# EAGLE schematic sparrow (EAGLE 6.5.0)

## Sheet 1 of 10: Microcontroller
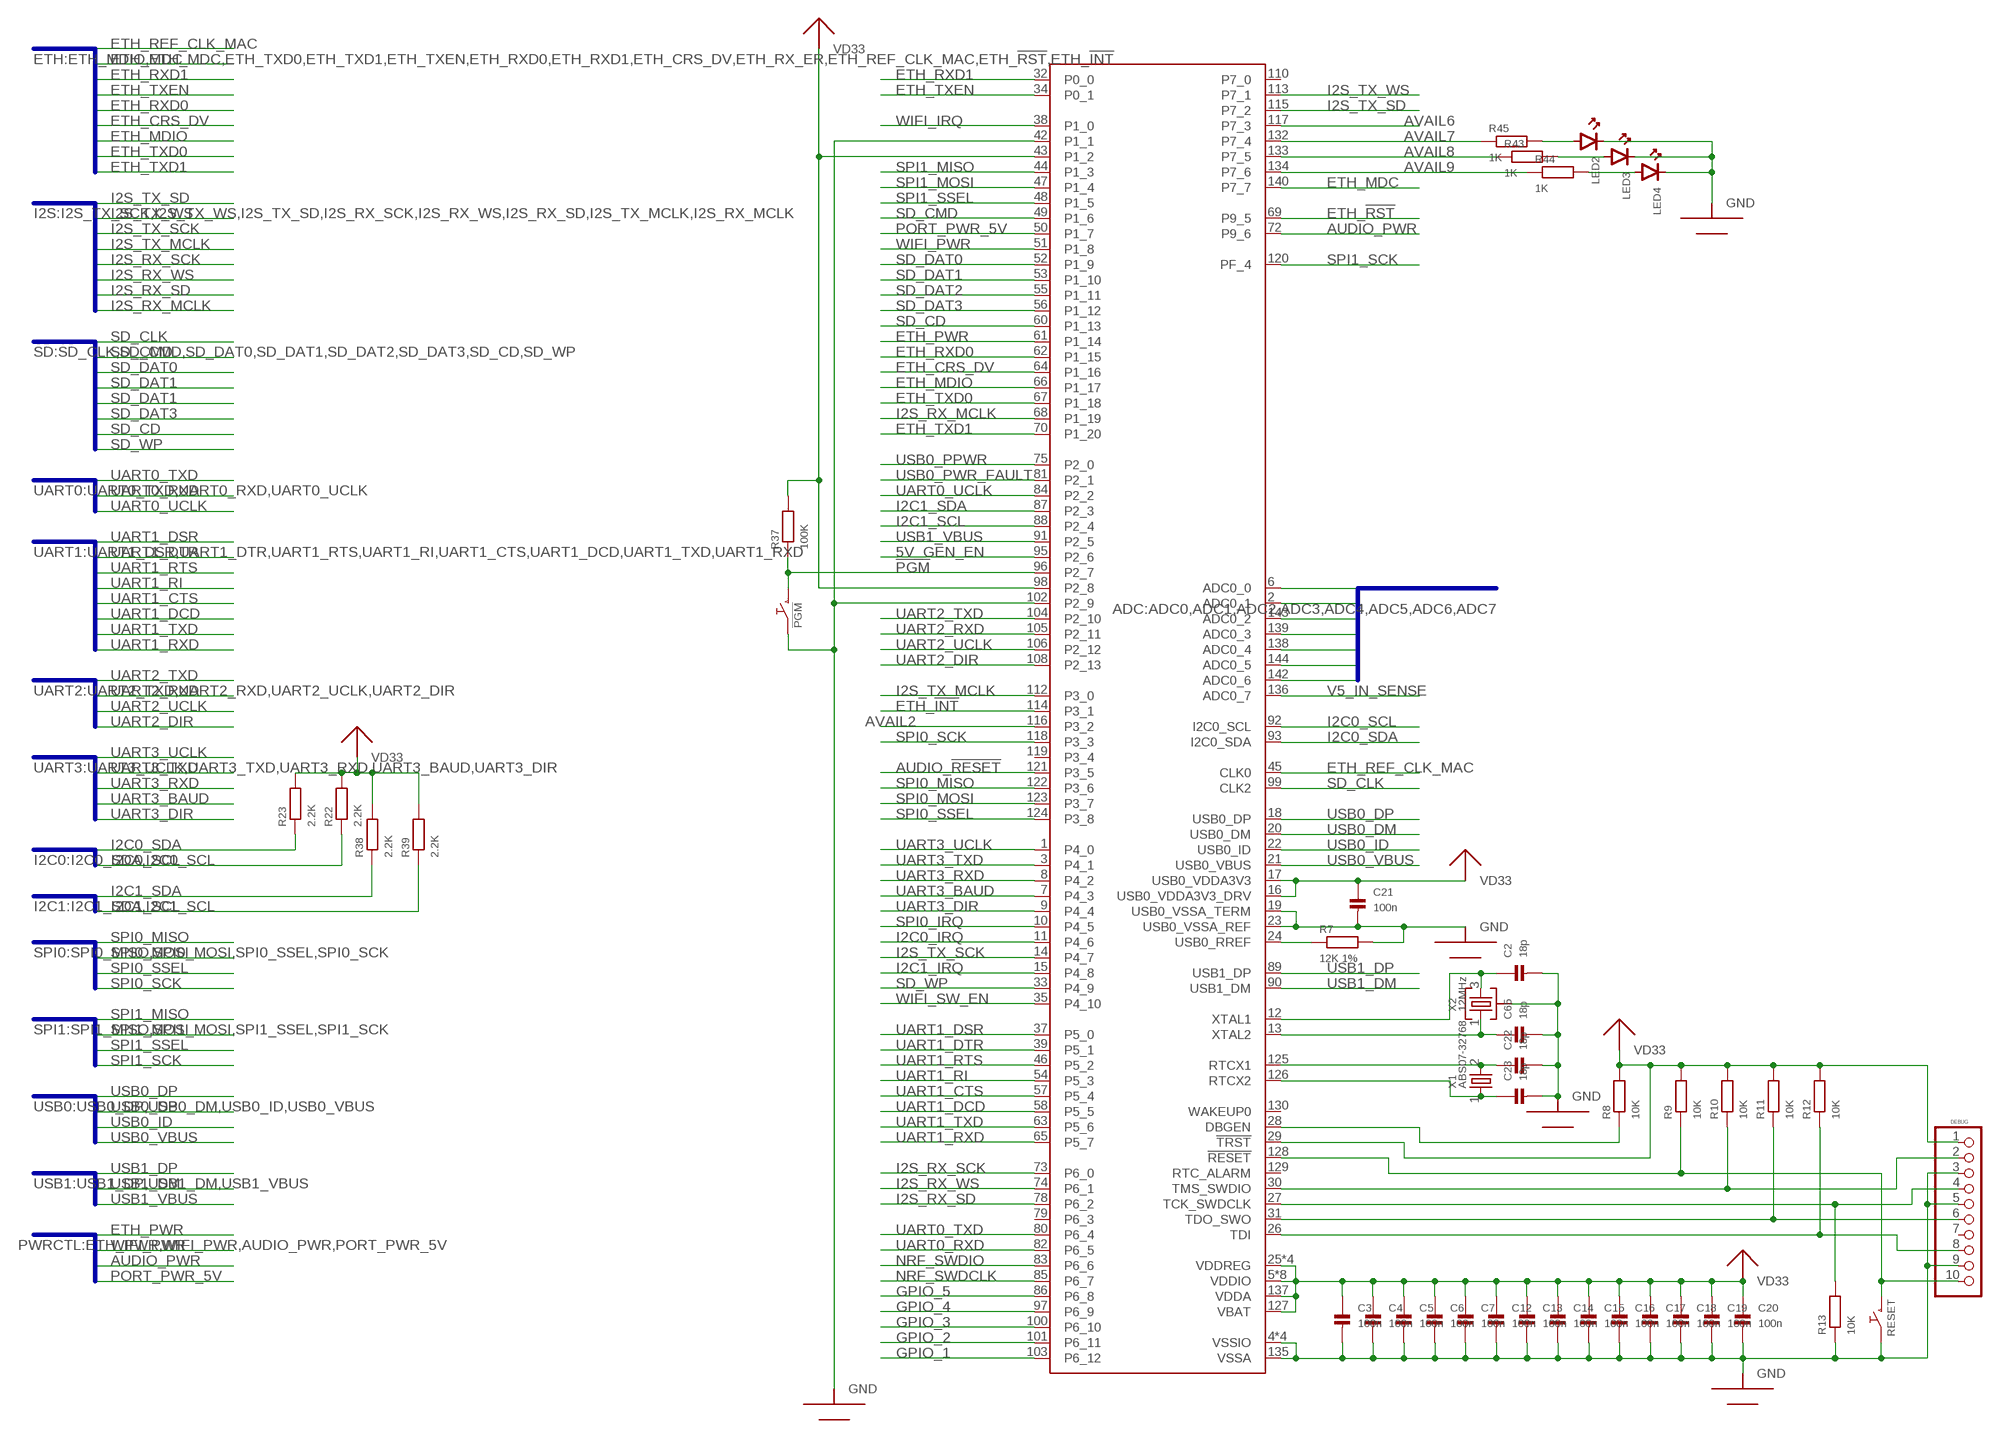
[diagram p0: schematic, sheet 1]

### Parts
!PGM  PUSHBUTTONKMR2XX  [CK-KMR2]
C2  18p  CAP_CERAMIC0603  [0603]
C3  100n  CAP_CERAMIC0603  [0603]
C4  100n  CAP_CERAMIC0603  [0603]
C5  100n  CAP_CERAMIC0603  [0603]
C6  100n  CAP_CERAMIC0603  [0603]
C7  100n  CAP_CERAMIC0603  [0603]
C12  100n  CAP_CERAMIC0603  [0603]
C13  100n  CAP_CERAMIC0603  [0603]
C14  100n  CAP_CERAMIC0603  [0603]
C15  100n  CAP_CERAMIC0603  [0603]
C16  100n  CAP_CERAMIC0603  [0603]
C17  100n  CAP_CERAMIC0603  [0603]
C18  100n  CAP_CERAMIC0603  [0603]
C19  100n  CAP_CERAMIC0603  [0603]
C20  100n  CAP_CERAMIC0603  [0603]
C21  100n  CAP_CERAMIC0603  [0603]
C22  18p  CAP_CERAMIC0603  [0603]
C23  18p  CAP_CERAMIC0603  [0603]
C65  18p  CAP_CERAMIC0603  [0603]
LED2  LED0603  [0603_POLAR]
LED3  LED0603  [0603_POLAR]
LED4  LED0603  [0603_POLAR]
LPC_DEBUG  DEBUG  HEADER-2X5SMD-1.27MM  [2X05_SMT]
MCU  LPC1837  LPC1837JBD144QFP144  [QFP144-0.5]
R7  12K 1%  R-EU_0603  [0603]
R8  10K  R-EU_0603  [0603]
R9  10K  R-EU_0603  [0603]
R10  10K  R-EU_0603  [0603]
R11  10K  R-EU_0603  [0603]
R12  10K  R-EU_0603  [0603]
R13  10K  R-EU_0603  [0603]
R22  2.2K  R-EU_0603  [0603]
R23  2.2K  R-EU_0603  [0603]
R37  100K  R-EU_0603  [0603]
R38  2.2K  R-EU_0603  [0603]
R39  2.2K  R-EU_0603  [0603]
R43  1K  R-EU_0603  [0603]
R44  1K  R-EU_0603  [0603]
R45  1K  R-EU_0603  [0603]
RESET  PUSHBUTTONKMR2XX  [CK-KMR2]
X1  ABS07-32768  CRYSTAL1206  [1206_MINIMELF_COMBO]
X2  12MHz  CRYSTAL_WITH_GROUNDABM8G  [ABM8G]

### Nets
5V_GEN_EN: MCU.95(P2_6) ; also sheet 2
!PGM: !PGM.P$3 !PGM.P$4 MCU.96(P2_7) R37.1
!RESET: LPC_DEBUG.10 MCU.128(!RESET) R9.1 RESET.P$3 RESET.P$4
ADC0: MCU.6(ADC0_0) ; also sheet 8
ADC1: MCU.2(ADC0_1) ; also sheet 8
ADC2: MCU.143(ADC0_2) ; also sheet 8
ADC3: MCU.139(ADC0_3) ; also sheet 8
ADC4: MCU.138(ADC0_4) ; also sheet 8
ADC5: MCU.144(ADC0_5) ; also sheet 8
ADC6: MCU.142(ADC0_6) ; also sheet 2,8
AUDIO_!RESET: MCU.121(P3_5) ; also sheet 7
AUDIO_PWR: MCU.72(P9_6) ; also sheet 2
AVAIL2: MCU.116(P3_2)
AVAIL6: MCU.117(P7_3)
AVAIL7: MCU.132(P7_4) R45.1
AVAIL8: MCU.133(P7_5) R43.1
AVAIL9: MCU.134(P7_6) R44.1
DBGEN: MCU.28(DBGEN) R8.1
ETH_!INT: MCU.114(P3_1) ; also sheet 4
ETH_!RST: MCU.69(P9_5) ; also sheet 4
ETH_CRS_DV: MCU.64(P1_16) ; also sheet 4
ETH_MDC: MCU.140(P7_7) ; also sheet 4
ETH_MDIO: MCU.66(P1_17) ; also sheet 4
ETH_PWR: MCU.61(P1_14) ; also sheet 2
ETH_REF_CLK_MAC: MCU.45(CLK0) ; also sheet 4
ETH_RXD0: MCU.62(P1_15) ; also sheet 4
ETH_RXD1: MCU.32(P0_0) ; also sheet 4
ETH_TXD0: MCU.67(P1_18) ; also sheet 4
ETH_TXD1: MCU.70(P1_20) ; also sheet 4
ETH_TXEN: MCU.34(P0_1) ; also sheet 4
GND: !PGM.P$1 !PGM.P$2 C2.2 C3.2 C4.2 C5.2 C6.2 C7.2 C12.2 C13.2 C14.2 C15.2 C16.2 C17.2 C18.2 C19.2 C20.2 C21.2 C22.2 C23.2 C65.2 LED2.K(CATHODE) LED3.K(CATHODE) LED4.K(CATHODE) LPC_DEBUG.3 LPC_DEBUG.5 LPC_DEBUG.9 MCU.4(VSSIO) MCU.19(USB0_VSSA_TERM) MCU.23(USB0_VSSA_REF) MCU.40(VSSIO) MCU.42(P1_1) MCU.76(VSSIO) MCU.102(P2_9) MCU.109(VSSIO) MCU.135(VSSA) R7.2 R13.1 RESET.P$1 RESET.P$2 X2.2(GND) X2.4(GND) ; also sheet 2,3,4,5,6,7,8,9
GPIO_1: MCU.103(P6_12) ; also sheet 8
GPIO_2: MCU.101(P6_11) ; also sheet 8
GPIO_3: MCU.100(P6_10) ; also sheet 8
GPIO_4: MCU.97(P6_9) ; also sheet 8
GPIO_5: MCU.86(P6_8) ; also sheet 8
I2C0_IRQ: MCU.11(P4_6) ; also sheet 8
I2C0_SCL: MCU.92(I2C0_SCL) R22.1 ; also sheet 7,8
I2C0_SDA: MCU.93(I2C0_SDA) R23.1 ; also sheet 7,8
I2C1_IRQ: MCU.15(P4_8) ; also sheet 8
I2C1_SCL: MCU.88(P2_4) R39.1 ; also sheet 8
I2C1_SDA: MCU.87(P2_3) R38.1 ; also sheet 8
I2S_RX_MCLK: MCU.68(P1_19) ; also sheet 7
I2S_RX_SCK: MCU.73(P6_0) ; also sheet 7
I2S_RX_SD: MCU.78(P6_2) ; also sheet 7
I2S_RX_WS: MCU.74(P6_1) ; also sheet 7
I2S_TX_MCLK: MCU.112(P3_0) ; also sheet 7
I2S_TX_SCK: MCU.14(P4_7) ; also sheet 7
I2S_TX_SD: MCU.115(P7_2) ; also sheet 7
I2S_TX_WS: MCU.113(P7_1) ; also sheet 7
N$1: LED2.A(ANODE) R45.2
N$2: LED3.A(ANODE) R43.2
N$3: LED4.A(ANODE) R44.2
NRF_SWDCLK: MCU.85(P6_7) ; also sheet 9
NRF_SWDIO: MCU.83(P6_6) ; also sheet 9
PORT_PWR_5V: MCU.50(P1_7) ; also sheet 2
RTXC1: C22.1 MCU.125(RTCX1) X1.2
RTXC2: C23.1 MCU.126(RTCX2) X1.1
SD_CD: MCU.60(P1_13) ; also sheet 6
SD_CLK: MCU.99(CLK2) ; also sheet 6
SD_CMD: MCU.49(P1_6) ; also sheet 6
SD_DAT0: MCU.52(P1_9) ; also sheet 6
SD_DAT1: MCU.53(P1_10) ; also sheet 6
SD_DAT2: MCU.55(P1_11) ; also sheet 6
SD_DAT3: MCU.56(P1_12) ; also sheet 6
SD_WP: MCU.33(P4_9) ; also sheet 6
SPI0_IRQ: MCU.10(P4_5) ; also sheet 8
SPI0_MISO: MCU.122(P3_6) ; also sheet 8
SPI0_MOSI: MCU.123(P3_7) ; also sheet 8
SPI0_SCK: MCU.118(P3_3) ; also sheet 8
SPI0_SSEL: MCU.124(P3_8) ; also sheet 8
SPI1_MISO: MCU.44(P1_3) ; also sheet 5
SPI1_MOSI: MCU.47(P1_4) ; also sheet 5
SPI1_SCK: MCU.120(PF_4) ; also sheet 5
SPI1_SSEL: MCU.48(P1_5) ; also sheet 5
SWDCLK: LPC_DEBUG.4 MCU.27(TCK_SWDCLK) R13.2
SWDIO: LPC_DEBUG.2 MCU.30(TMS_SWDIO) R10.1
TDI: LPC_DEBUG.8 MCU.26(TDI) R12.1
TDO_SWO: LPC_DEBUG.6 MCU.31(TDO_SWO) R11.1
UART0_RXD: MCU.82(P6_5) ; also sheet 8
UART0_TXD: MCU.80(P6_4) ; also sheet 8
UART0_UCLK: MCU.84(P2_2) ; also sheet 8
UART1_CTS: MCU.57(P5_4) ; also sheet 9
UART1_DCD: MCU.58(P5_5)
UART1_DSR: MCU.37(P5_0)
UART1_DTR: MCU.39(P5_1)
UART1_RI: MCU.54(P5_3)
UART1_RTS: MCU.46(P5_2) ; also sheet 9
UART1_RXD: MCU.65(P5_7) ; also sheet 9
UART1_TXD: MCU.63(P5_6) ; also sheet 9
UART2_DIR: MCU.108(P2_13) ; also sheet 8
UART2_RXD: MCU.105(P2_11) ; also sheet 8
UART2_TXD: MCU.104(P2_10) ; also sheet 8
UART2_UCLK: MCU.106(P2_12) ; also sheet 8
UART3_BAUD: MCU.7(P4_3) ; also sheet 8
UART3_DIR: MCU.9(P4_4) ; also sheet 8
UART3_RXD: MCU.8(P4_2) ; also sheet 8
UART3_TXD: MCU.3(P4_1) ; also sheet 8
UART3_UCLK: MCU.1(P4_0) ; also sheet 8
USB0_DM: MCU.20(USB0_DM) ; also sheet 3
USB0_DP: MCU.18(USB0_DP) ; also sheet 3
USB0_ID: MCU.22(USB0_ID) ; also sheet 3
USB0_PPWR: MCU.75(P2_0) ; also sheet 2
USB0_PWR_FAULT: MCU.81(P2_1) ; also sheet 2
USB0_RREF: MCU.24(USB0_RREF) R7.1
USB0_VBUS: MCU.21(USB0_VBUS) ; also sheet 3
USB1_DM: MCU.90(USB1_DM) ; also sheet 3
USB1_DP: MCU.89(USB1_DP) ; also sheet 3
USB1_VBUS: MCU.91(P2_5) ; also sheet 3
V5_IN_SENSE: MCU.136(ADC0_7) ; also sheet 2
VD33: C3.1 C4.1 C5.1 C6.1 C7.1 C12.1 C13.1 C14.1 C15.1 C16.1 C17.1 C18.1 C19.1 C20.1 C21.1 LPC_DEBUG.1 MCU.5(VDDIO) MCU.16(USB0_VDDA3V3_DRV) MCU.17(USB0_VDDA3V3) MCU.25(VDDREG) MCU.29(!TRST) MCU.36(VDDIO) MCU.41(VDDIO) MCU.43(P1_2) MCU.59(VDDREG) MCU.71(VDDIO) MCU.77(VDDIO) MCU.94(VDDREG) MCU.98(P2_8) MCU.107(VDDIO) MCU.111(VDDIO) MCU.127(VBAT) MCU.131(VDDREG) MCU.137(VDDA) MCU.141(VDDIO) R8.2 R9.2 R10.2 R11.2 R12.2 R22.2 R23.2 R37.2 R38.2 R39.2 ; also sheet 2,6,7,8,9
WIFI_IRQ: MCU.38(P1_0) ; also sheet 5
WIFI_PWR: MCU.51(P1_8) ; also sheet 2
WIFI_SW_EN: MCU.35(P4_10) ; also sheet 5
XTAL1: C2.1 MCU.12(XTAL1) X2.3
XTAL2: C65.1 MCU.13(XTAL2) X2.1
Unconnected: LPC_DEBUG.7 MCU.79(P6_3) MCU.110(P7_0) MCU.119(P3_4) MCU.129(RTC_ALARM) MCU.130(WAKEUP0)

### Buses
USB0:USB0_DP,USB0_DM,USB0_ID,USB0_VBUS
USB1:USB1_DP,USB1_DM,USB1_VBUS
ADC:ADC0,ADC1,ADC2,ADC3,ADC4,ADC5,ADC6,ADC7
ETH:ETH_MDIO,ETH_MDC,ETH_TXD0,ETH_TXD1,ETH_TXEN,ETH_RXD0,ETH_RXD1,ETH_CRS_DV,ETH_RX_ER,ETH_REF_CLK_MAC,ETH_!RST,ETH_!INT
I2C0:I2C0_SDA,I2C0_SCL
I2S:I2S_TX_SCK,I2S_TX_WS,I2S_TX_SD,I2S_RX_SCK,I2S_RX_WS,I2S_RX_SD,I2S_TX_MCLK,I2S_RX_MCLK
SD:SD_CLK,SD_CMD,SD_DAT0,SD_DAT1,SD_DAT2,SD_DAT3,SD_CD,SD_WP
UART1:UART1_DSR,UART1_DTR,UART1_RTS,UART1_RI,UART1_CTS,UART1_DCD,UART1_TXD,UART1_RXD
UART0:UART0_TXD,UART0_RXD,UART0_UCLK
UART2:UART2_TXD,UART2_RXD,UART2_UCLK,UART2_DIR
UART3:UART3_UCLK,UART3_TXD,UART3_RXD,UART3_BAUD,UART3_DIR
I2C1:I2C1_SDA,I2C1_SCL
SPI0:SPI0_MISO,SPI0_MOSI,SPI0_SSEL,SPI0_SCK
SPI1:SPI1_MISO,SPI1_MOSI,SPI1_SSEL,SPI1_SCK
PWRCTL:ETH_PWR,WIFI_PWR,AUDIO_PWR,PORT_PWR_5V

## Sheet 2 of 10: Power
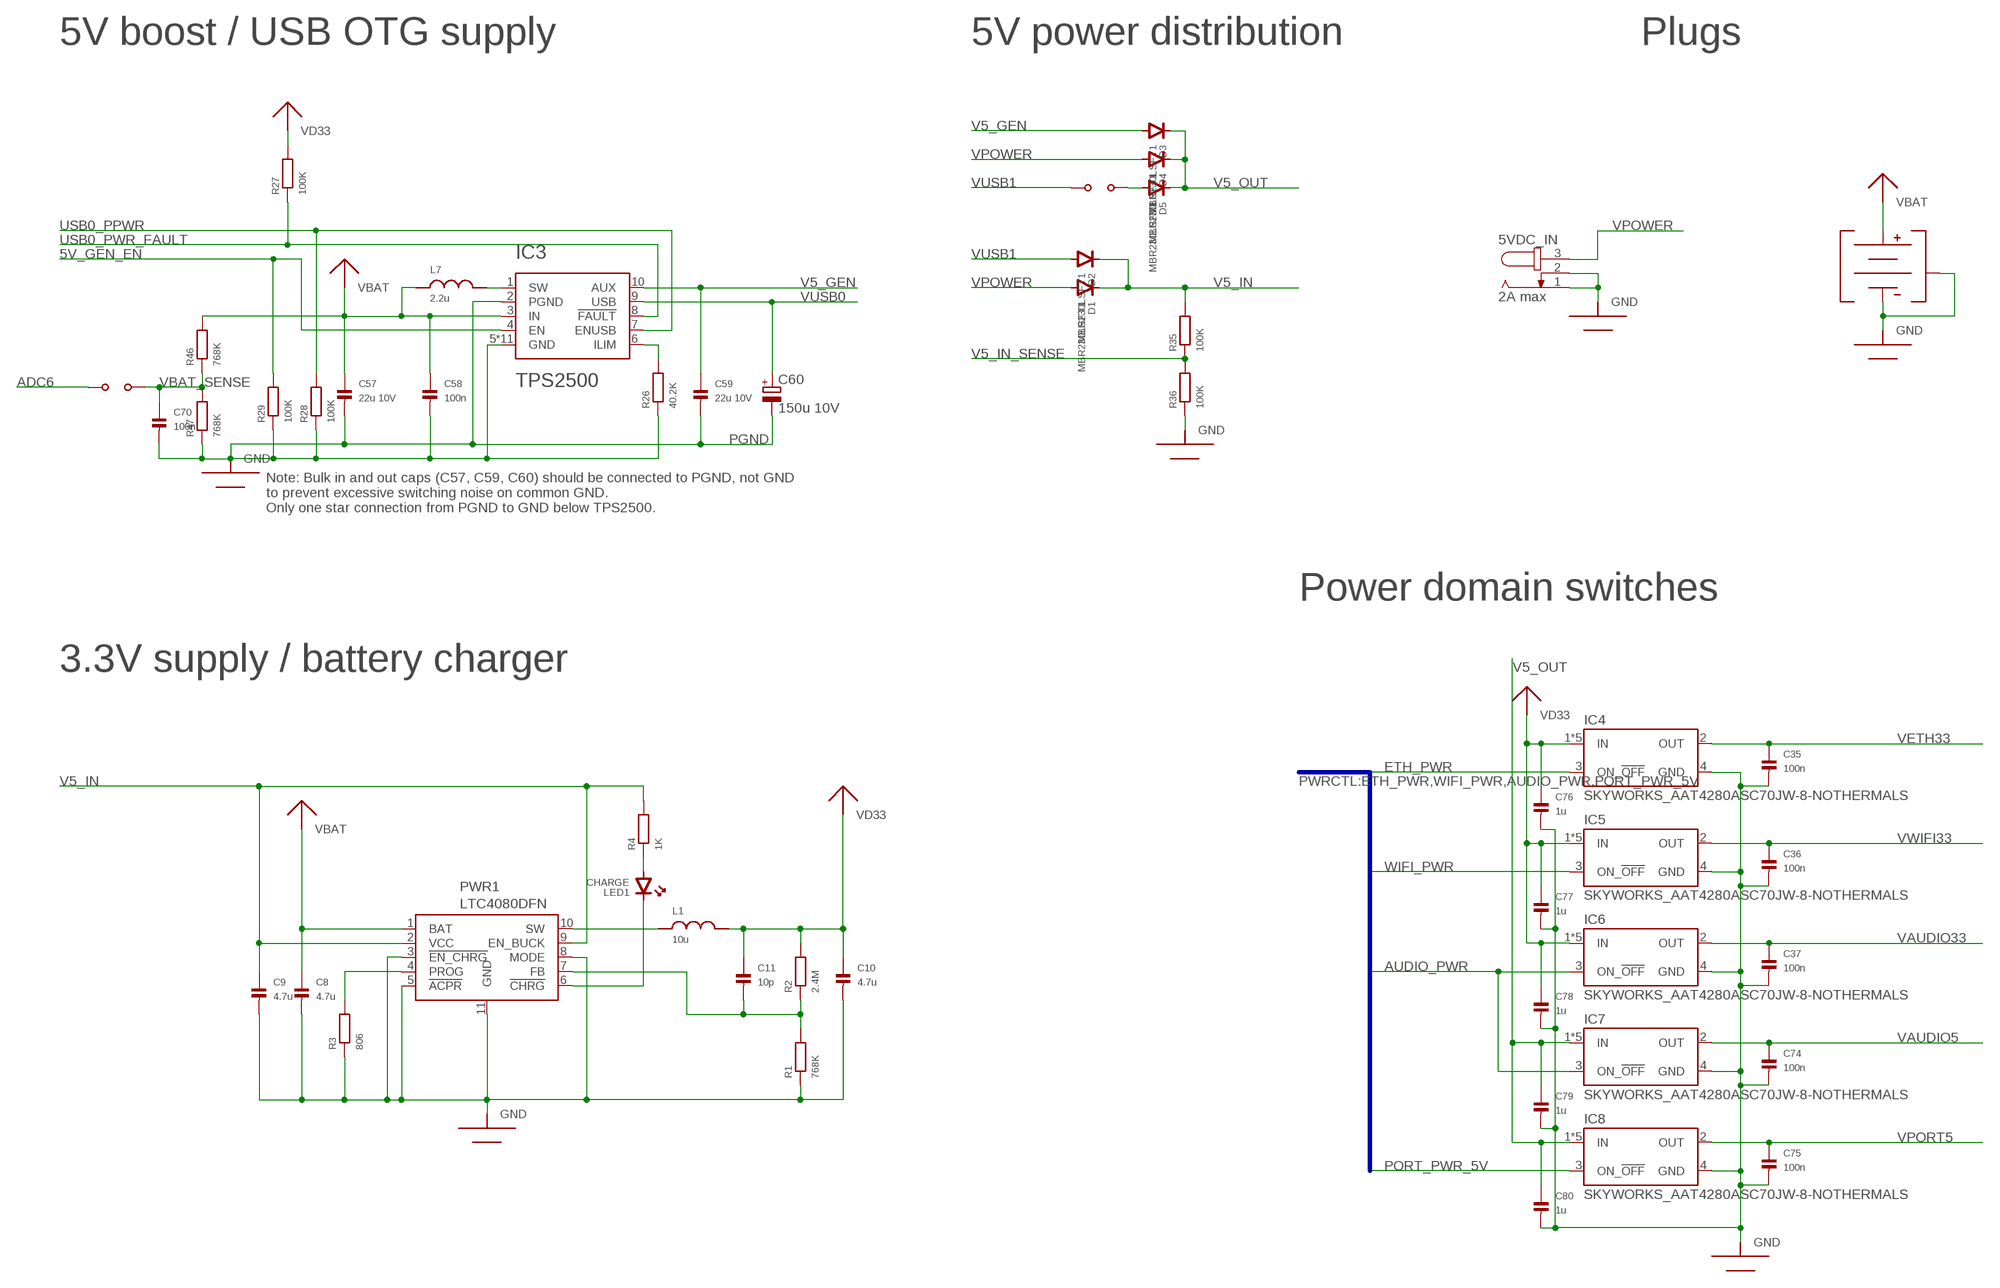
[diagram p1: schematic, sheet 2]

### Parts
5VDC_IN  2A max  JACK-PLUGCUI_PJ102BH  [CUI_PJ_102BH]
BATSNS  JUMPERSOLDER_CLOSED  [0603_SOLDERJUMPER_CLOSED]
BATT  BATTERY_WITH_HOLDER  [S2B-PH-SM4-TB]
C8  4.7u  CAP_CERAMIC0603  [0603]
C9  4.7u  CAP_CERAMIC0603  [0603]
C10  4.7u  CAP_CERAMIC0603  [0603]
C11  10p  CAP_CERAMIC0603  [0603]
C35  100n  CAP_CERAMIC0603  [0603]
C36  100n  CAP_CERAMIC0603  [0603]
C37  100n  CAP_CERAMIC0603  [0603]
C57  22u 10V  CAP_CERAMIC0805  [0805]
C58  100n  CAP_CERAMIC0603  [0603]
C59  22u 10V  CAP_CERAMIC0805  [0805]
C60  150u 10V  CPOL-EU1210  [1210_POLAR]
C70  100n  CAP_CERAMIC0603  [0603]
C74  100n  CAP_CERAMIC0603  [0603]
C75  100n  CAP_CERAMIC0603  [0603]
C76  1u  CAP_CERAMIC0603  [0603]
C77  1u  CAP_CERAMIC0603  [0603]
C78  1u  CAP_CERAMIC0603  [0603]
C79  1u  CAP_CERAMIC0603  [0603]
C80  1u  CAP_CERAMIC0603  [0603]
D1  MBR230LSFT1  DIODESOD123FL  [SOD123FL]
D2  MBR230LSFT1  DIODESOD123FL  [SOD123FL]
D3  MBR230LSFT1  DIODESOD123FL  [SOD123FL]
D4  MBR230LSFT1  DIODESOD123FL  [SOD123FL]
D5  MBR230LSFT1  DIODESOD123FL  [SOD123FL]
IC3  TPS2500  TPS2500SON10  [SON10-0.5-EP-VIAS]
IC4  SKYWORKS_AAT4280ASC70JW-8-NOTHERMALS  [SC70JW-8-NOTHERMALS]
IC5  SKYWORKS_AAT4280ASC70JW-8-NOTHERMALS  [SC70JW-8-NOTHERMALS]
IC6  SKYWORKS_AAT4280ASC70JW-8-NOTHERMALS  [SC70JW-8-NOTHERMALS]
IC7  SKYWORKS_AAT4280ASC70JW-8-NOTHERMALS  [SC70JW-8-NOTHERMALS]
IC8  SKYWORKS_AAT4280ASC70JW-8-NOTHERMALS  [SC70JW-8-NOTHERMALS]
L1  10u  INDUCTOR40X40MM  [INDUCTOR_40X40]
L7  2.2u  INDUCTOR40X40MM  [INDUCTOR_40X40]
LED1  CHARGE  LED0603  [0603_POLAR]
LIM  JUMPERSOLDER_OPEN  [0603_SOLDERJUMPER_OPEN]
PWR1  LTC4080DFN  [LTC4080_DFN]
R1  768K  R-EU_0603  [0603]
R2  2.4M  R-EU_0603  [0603]
R3  806  R-EU_0603  [0603]
R4  1K  R-EU_0603  [0603]
R26  40.2K  R-EU_0603  [0603]
R27  100K  R-EU_0603  [0603]
R28  100K  R-EU_0603  [0603]
R29  100K  R-EU_0603  [0603]
R35  100K  R-EU_0603  [0603]
R36  100K  R-EU_0603  [0603]
R46  768K  R-EU_0603  [0603]
R47  768K  R-EU_0603  [0603]

### Nets
5V_BOOST_SW: IC3.1(SW) L7.P$2
5V_GEN_EN: IC3.4(EN) R29.2 ; also sheet 1
5V_ILIM: IC3.6(ILIM) R26.2
ADC6: BATSNS.1 ; also sheet 1,8
AUDIO_PWR: IC6.3(ON_!OFF) IC7.3(ON_!OFF) ; also sheet 1
CHARGE_!CHRG: LED1.K(CATHODE) PWR1.6(!CHRG)
CHARGE_!CHRG_CURR: LED1.A(ANODE) R4.1
CHARGE_FB: C11.2 PWR1.7(FB) R1.2 R2.1
CHARGE_PROG: PWR1.4(PROG) R3.2
CHARGE_SW: L1.P$1 PWR1.10(SW)
ETH_PWR: IC4.3(ON_!OFF) ; also sheet 1
GND: 5VDC_IN.1 5VDC_IN.2 BATT.2(-) BATT.3(HOLDER) BATT.4(HOLDER) C8.2 C9.2 C10.2 C35.2 C36.2 C37.2 C57.2 C58.2 C59.2 C60.K(-) C70.2 C74.2 C75.2 C76.2 C77.2 C78.2 C79.2 C80.2 IC3.2(PGND) IC3.5(GND) IC3.EXT1(GND) IC3.EXT2(GND) IC3.EXT3(GND) IC3.EXT4(GND) IC3.PAD(GND) IC3.THERM1(GND) IC3.THERM2(GND) IC3.THERM3(GND) IC3.THERM4(GND) IC3.THERM5(GND) IC4.4(GND) IC5.4(GND) IC6.4(GND) IC7.4(GND) IC8.4(GND) PWR1.3(!EN_CHRG) PWR1.5(!ACPR) PWR1.8(MODE) PWR1.11(GND) R1.1 R3.1 R26.1 R28.1 R29.1 R36.1 R47.1 ; also sheet 1,3,4,5,6,7,8,9
PORT_PWR_5V: IC8.3(ON_!OFF) ; also sheet 1
USB0_PPWR: IC3.7(ENUSB) R28.2 ; also sheet 1
USB0_PWR_FAULT: IC3.8(!FAULT) R27.1 ; also sheet 1
V5_GEN [supply2000]: C59.1 D3.A(ANODE) IC3.10(AUX)
V5_IN [supply500]: C9.1 D1.K(CATHODE) D2.K(CATHODE) PWR1.2(VCC) PWR1.9(EN_BUCK) R4.2 R35.2
V5_IN_SENSE: R35.1 R36.2 ; also sheet 1
V5_OUT [supply2000]: C79.1 C80.1 D3.K(CATHODE) D4.K(CATHODE) D5.K(CATHODE) IC7.1(IN) IC7.5(IN) IC7.6(IN) IC7.7(IN) IC7.8(IN) IC8.1(IN) IC8.5(IN) IC8.6(IN) IC8.7(IN) IC8.8(IN)
VAUDIO5 [supply2000]: C74.1 IC7.2(OUT) ; also sheet 7
VAUDIO33: C37.1 IC6.2(OUT) ; also sheet 7
VBAT [supply2000]: BATT.1(+) C8.1 C57.1 C58.1 IC3.3(IN) L7.P$1 PWR1.1(BAT) R46.2
VBAT_SENSE: BATSNS.2 C70.1 R46.1 R47.2
VD33: C10.1 C11.1 C76.1 C77.1 C78.1 IC4.1(IN) IC4.5(IN) IC4.6(IN) IC4.7(IN) IC4.8(IN) IC5.1(IN) IC5.5(IN) IC5.6(IN) IC5.7(IN) IC5.8(IN) IC6.1(IN) IC6.5(IN) IC6.6(IN) IC6.7(IN) IC6.8(IN) L1.P$2 R2.2 R27.2 ; also sheet 1,6,7,8,9
VETH33: C35.1 IC4.2(OUT) ; also sheet 4
VPORT5 [supply2000]: C75.1 IC8.2(OUT) ; also sheet 8
VPOWER [supply2000]: 5VDC_IN.3 D1.A(ANODE) D4.A(ANODE)
VUSB0 [supply500]: C60.A(+) IC3.9(USB) ; also sheet 3
VUSB1 [supply2000]: D2.A(ANODE) LIM.1 ; also sheet 3
VUSB1_V5_OUT [supply2000]: D5.A(ANODE) LIM.2
VWIFI33: C36.1 IC5.2(OUT) ; also sheet 5
WIFI_PWR: IC5.3(ON_!OFF) ; also sheet 1

### Buses
PWRCTL:ETH_PWR,WIFI_PWR,AUDIO_PWR,PORT_PWR_5V

### Notes on the sheet
- 5V boost / USB OTG supply | 5V power distribution | Plugs
- PGND
- Note: Bulk in and out caps (C57, C59, C60) should be connected to PGND, not GND
  to prevent excessive switching noise on common GND.
  Only one star connection from PGND to GND below TPS2500.
- Power domain switches
- 3.3V supply / battery charger

## Sheet 3 of 10: USB
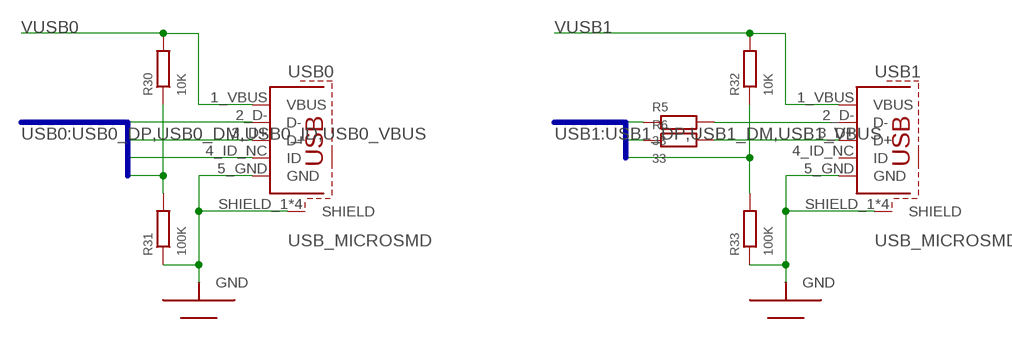
[diagram p2: schematic, sheet 3]

### Parts
R5  33  R-EU_0603  [0603]
R6  33  R-EU_0603  [0603]
R30  10K  R-EU_0603  [0603]
R31  100K  R-EU_0603  [0603]
R32  10K  R-EU_0603  [0603]
R33  100K  R-EU_0603  [0603]
USB0  USB_MICROSMD  [USB_MICRO_SMD]
USB1  USB_MICROSMD  [USB_MICRO_SMD]

### Nets
GND: R31.1 R33.1 USB0.5_GND(GND) USB0.SHIELD_1(SHIELD) USB0.SHIELD_2(SHIELD) USB0.SHIELD_3(SHIELD) USB0.SHIELD_4(SHIELD) USB1.5_GND(GND) USB1.SHIELD_1(SHIELD) USB1.SHIELD_2(SHIELD) USB1.SHIELD_3(SHIELD) USB1.SHIELD_4(SHIELD) ; also sheet 1,2,4,5,6,7,8,9
USB0_DM: USB0.2_D-(D-) ; also sheet 1
USB0_DP: USB0.3_D+(D+) ; also sheet 1
USB0_ID: USB0.4_ID_NC(ID) ; also sheet 1
USB0_VBUS: R30.1 R31.2 ; also sheet 1
USB1_DM: R5.1 ; also sheet 1
USB1_DM_LINE: R5.2 USB1.2_D-(D-)
USB1_DP: R6.1 ; also sheet 1
USB1_VBUS: R32.1 R33.2 ; also sheet 1
USB_DP_LINE: R6.2 USB1.3_D+(D+)
VUSB0 [supply500]: R30.2 USB0.1_VBUS(VBUS) ; also sheet 2
VUSB1 [supply2000]: R32.2 USB1.1_VBUS(VBUS) ; also sheet 2
Unconnected: USB1.4_ID_NC(ID)

### Buses
USB0:USB0_DP,USB0_DM,USB0_ID,USB0_VBUS
USB1:USB1_DP,USB1_DM,USB1_VBUS

## Sheet 4 of 10: Ethernet
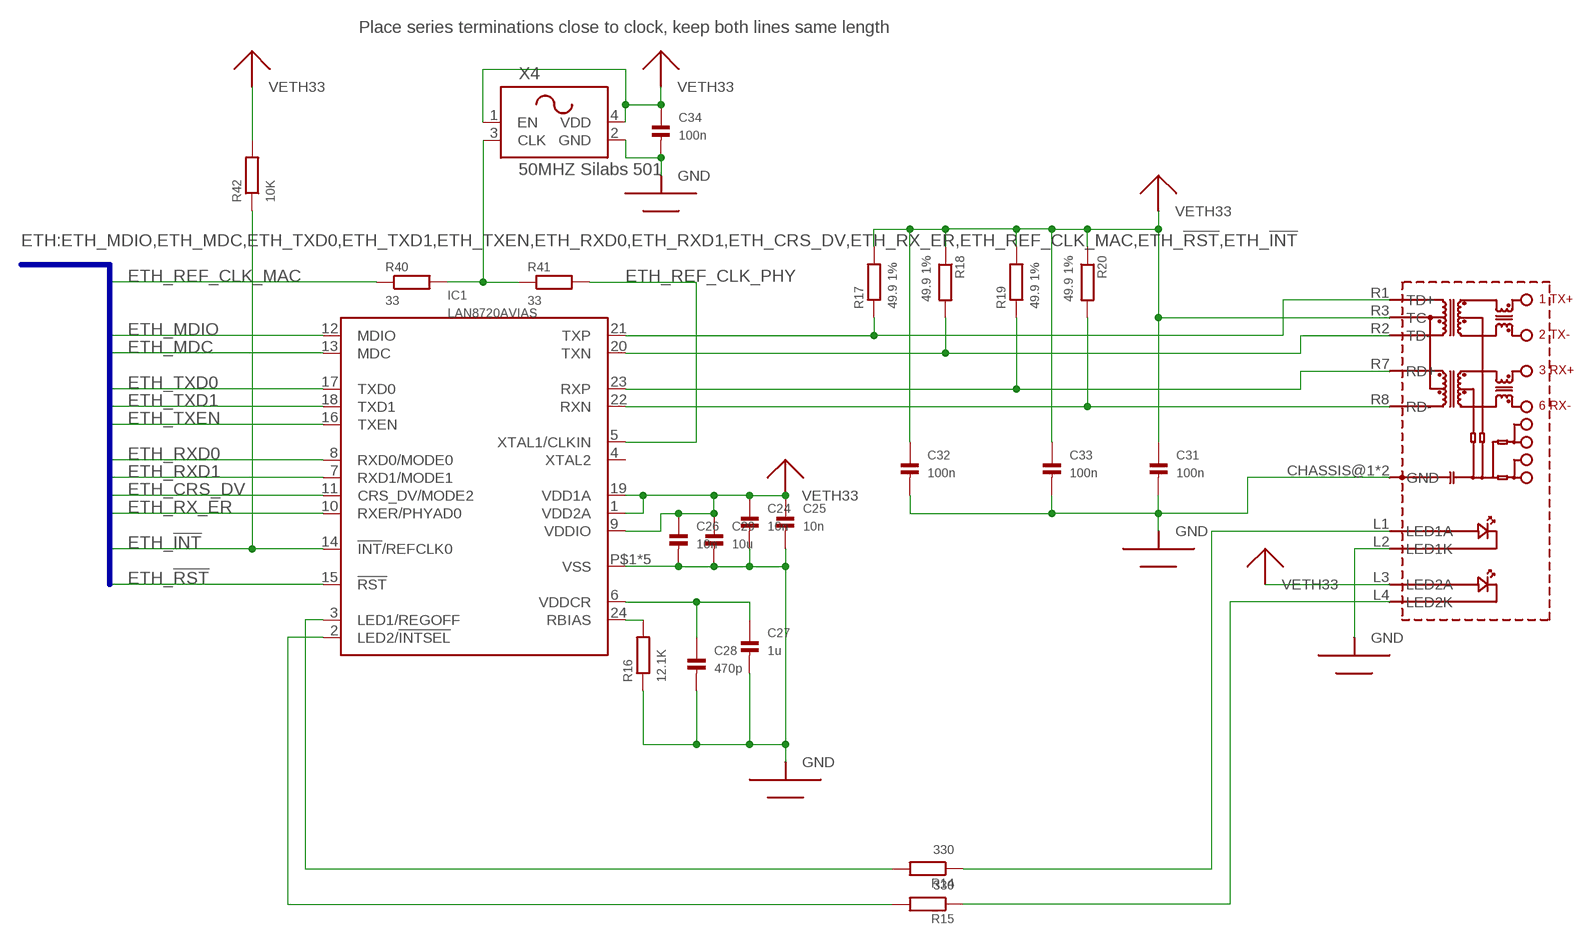
[diagram p3: schematic, sheet 4]

### Parts
C24  10n  CAP_CERAMIC0603  [0603]
C25  10n  CAP_CERAMIC0603  [0603]
C26  10n  CAP_CERAMIC0603  [0603]
C27  1u  CAP_CERAMIC0603  [0603]
C28  470p  CAP_CERAMIC0603  [0603]
C29  10u  CAP_CERAMIC0603  [0603]
C31  100n  CAP_CERAMIC0603  [0603]
C32  100n  CAP_CERAMIC0603  [0603]
C33  100n  CAP_CERAMIC0603  [0603]
C34  100n  CAP_CERAMIC0603  [0603]
ETH  ETHERNET_JACK_LEDSRB1-125BAG1A  [RJ45-RB1-125BAG1A]
IC1  LAN8720AVIAS  [QFN24-0.5-EP-VIAS]
R14  330  R-EU_0603  [0603]
R15  330  R-EU_0603  [0603]
R16  12.1K  R-EU_0603  [0603]
R17  49.9 1%  R-EU_0603  [0603]
R18  49.9 1%  R-EU_0603  [0603]
R19  49.9 1%  R-EU_0603  [0603]
R20  49.9 1%  R-EU_0603  [0603]
R40  33  R-EU_0603  [0603]
R41  33  R-EU_0603  [0603]
R42  10K  R-EU_0603  [0603]
X4  50MHZ Silabs 501  OSCILLATOR25X20  [CRYSTAL25X20]

### Nets
ETH_!INT: IC1.14(!INT!/REFCLK0) R42.1 ; also sheet 1
ETH_!RST: IC1.15(!RST) ; also sheet 1
ETH_CRS_DV: IC1.11(CRS_DV/MODE2) ; also sheet 1
ETH_LED1: IC1.3(LED1/REGOFF) R14.2
ETH_LED1_CURR: ETH.L1(LED1A) R14.1
ETH_LED2: IC1.2(LED2/!INTSEL) R15.2
ETH_LED2_CURR: ETH.L4(LED2K) R15.1
ETH_MDC: IC1.13(MDC) ; also sheet 1
ETH_MDIO: IC1.12(MDIO) ; also sheet 1
ETH_RBIAS: IC1.24(RBIAS) R16.2
ETH_REF_CLK: R40.2 R41.1 X4.3(CLK)
ETH_REF_CLK_MAC: R40.1 ; also sheet 1
ETH_REF_CLK_PHY: IC1.5(XTAL1/CLKIN) R41.2
ETH_RX_ER: IC1.10(RXER/PHYAD0)
ETH_RXD0: IC1.8(RXD0/MODE0) ; also sheet 1
ETH_RXD1: IC1.7(RXD1/MODE1) ; also sheet 1
ETH_RXN: ETH.R8(RD-) IC1.22(RXN) R20.2
ETH_RXP: ETH.R7(RD+) IC1.23(RXP) R19.1
ETH_TXD0: IC1.17(TXD0) ; also sheet 1
ETH_TXD1: IC1.18(TXD1) ; also sheet 1
ETH_TXEN: IC1.16(TXEN) ; also sheet 1
ETH_TXN: ETH.R2(TD-) IC1.20(TXN) R18.2
ETH_TXP: ETH.R1(TD+) IC1.21(TXP) R17.1
ETH_VDDCR: C27.1 C28.1 IC1.6(VDDCR)
GND: C24.2 C25.2 C26.2 C27.2 C28.2 C29.2 C31.2 C32.2 C33.2 C34.2 ETH.CHASSIS@1(GND) ETH.CHASSIS@2(GND) ETH.L2(LED1K) IC1.P$1(VSS) IC1.P$2(VSS) IC1.P$3(VSS) IC1.P$4(VSS) IC1.PAD(VSS) R16.1 X4.2(GND) ; also sheet 1,2,3,5,6,7,8,9
VETH33: C24.1 C25.1 C26.1 C29.1 C31.1 C32.1 C33.1 C34.1 ETH.L3(LED2A) ETH.R3(TC) IC1.1(VDD2A) IC1.9(VDDIO) IC1.19(VDD1A) R17.2 R18.1 R19.2 R20.1 R42.2 X4.1(EN) X4.4(VDD) ; also sheet 2
Unconnected: IC1.4(XTAL2)

### Buses
ETH:ETH_MDIO,ETH_MDC,ETH_TXD0,ETH_TXD1,ETH_TXEN,ETH_RXD0,ETH_RXD1,ETH_CRS_DV,ETH_RX_ER,ETH_REF_CLK_MAC,ETH_!RST,ETH_!INT

### Notes on the sheet
- Place series terminations close to clock, keep both lines same length

## Sheet 5 of 10: WIFI
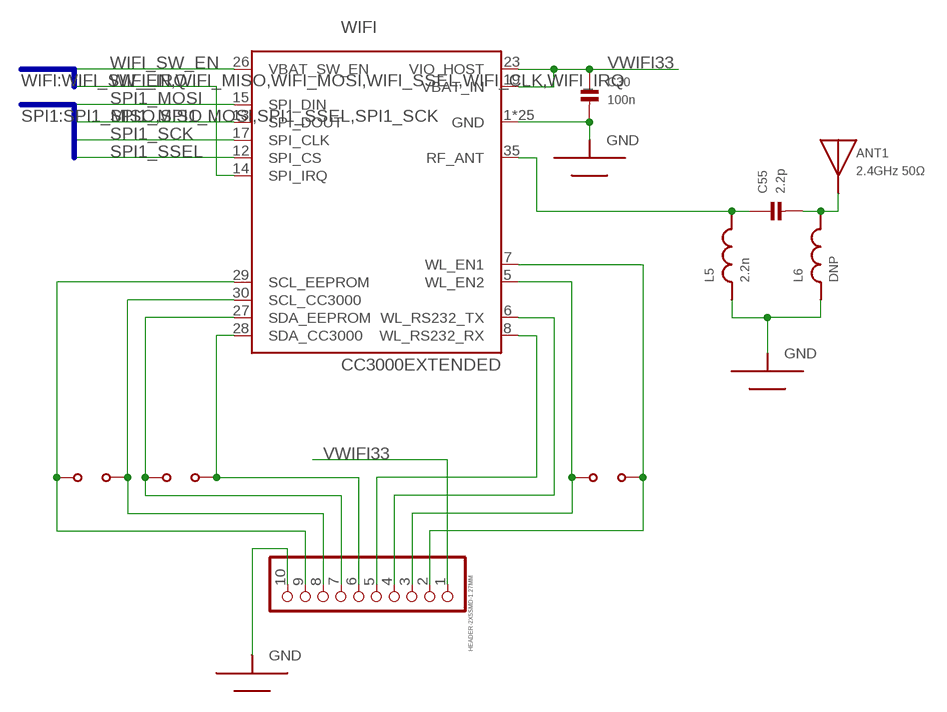
[diagram p4: schematic, sheet 5]

### Parts
ANT1  2.4GHz 50Ω  ANTENNA_MONOPOLE1206  [1206_MINIMELF_COMBO]
C30  100n  CAP_CERAMIC0603  [0603]
C55  2.2p  CAP_CERAMIC0402  [0402]
CC_DEBUG  HEADER-2X5SMD-1.27MM  [2X05_SMT]
L5  2.2n  INDUCTOR0402  [0402]
L6  DNP  INDUCTOR0402  [0402]
SCL  JUMPERSOLDER_CLOSED  [0603_SOLDERJUMPER_CLOSED]
SDA  JUMPERSOLDER_CLOSED  [0603_SOLDERJUMPER_CLOSED]
WIFI  CC3000EXTENDED  [CC3000-EXT]
WL_EN  JUMPERSOLDER_CLOSED  [0603_SOLDERJUMPER_CLOSED]

### Nets
GND: C30.2 CC_DEBUG.10 L5.P$1 L6.P$1 WIFI.1(GND) WIFI.9(GND) WIFI.10(GND) WIFI.11(GND) WIFI.16(GND) WIFI.18(GND) WIFI.20(GND) WIFI.21(GND) WIFI.22(GND) WIFI.25(GND) WIFI.31(GND) WIFI.32(GND) WIFI.33(GND) WIFI.34(GND) WIFI.36(GND) WIFI.37(GND) WIFI.38(GND) WIFI.39(GND) WIFI.40(GND) WIFI.41(GND) WIFI.42(GND) WIFI.43(GND) WIFI.44(GND) WIFI.45(GND) WIFI.46(GND) ; also sheet 1,2,3,4,6,7,8,9
SPI1_MISO: WIFI.13(SPI_DOUT) ; also sheet 1
SPI1_MOSI: WIFI.15(SPI_DIN) ; also sheet 1
SPI1_SCK: WIFI.17(SPI_CLK) ; also sheet 1
SPI1_SSEL: WIFI.12(SPI_CS) ; also sheet 1
VWIFI33: C30.1 CC_DEBUG.1 WIFI.19(VBAT_IN) WIFI.23(VIO_HOST) ; also sheet 2
WIFI_ANT: ANT1.1(ANT) C55.P$2 L6.P$2
WIFI_ANT_UNBAL: C55.P$1 L5.P$2 WIFI.35(RF_ANT)
WIFI_IRQ: WIFI.14(SPI_IRQ) ; also sheet 1
WIFI_SCL_CC3000: CC_DEBUG.8 SCL.1 WIFI.30(SCL_CC3000)
WIFI_SCL_EEPROM: CC_DEBUG.9 SCL.2 WIFI.29(SCL_EEPROM)
WIFI_SDA_CC3000: CC_DEBUG.6 SDA.1 WIFI.28(SDA_CC3000)
WIFI_SDA_EEPROM: CC_DEBUG.7 SDA.2 WIFI.27(SDA_EEPROM)
WIFI_SW_EN: WIFI.26(VBAT_SW_EN) ; also sheet 1
WL_EN1: CC_DEBUG.2 WIFI.7(WL_EN1) WL_EN.1
WL_EN2: CC_DEBUG.3 WIFI.5(WL_EN2) WL_EN.2
WL_RS232_RX: CC_DEBUG.5 WIFI.8(WL_RS232_RX)
WL_RS232_TX: CC_DEBUG.4 WIFI.6(WL_RS232_TX)

### Buses
WIFI:WIFI_SW_EN,WIFI_MISO,WIFI_MOSI,WIFI_SSEL,WIFI_CLK,WIFI_IRQ
SPI1:SPI1_MISO,SPI1_MOSI,SPI1_SSEL,SPI1_SCK

## Sheet 6 of 10: SD
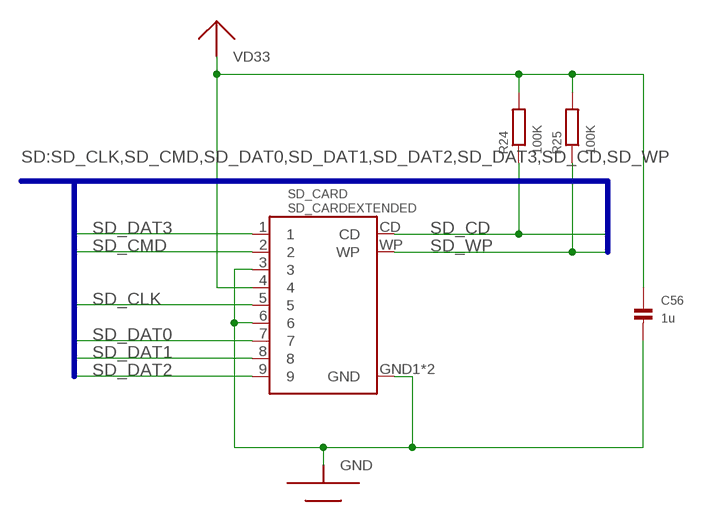
[diagram p5: schematic, sheet 6]

### Parts
C56  1u  CAP_CERAMIC0603  [0603]
R24  100K  R-EU_0603  [0603]
R25  100K  R-EU_0603  [0603]
SD_CARD  SD_CARDEXTENDED  [AMPHENO_101_00313_EXT_PADS]

### Nets
GND: C56.2 SD_CARD.3 SD_CARD.6 SD_CARD.GND1(GND) SD_CARD.GND2(GND) ; also sheet 1,2,3,4,5,7,8,9
SD_CD: R24.1 SD_CARD.CD ; also sheet 1
SD_CLK: SD_CARD.5 ; also sheet 1
SD_CMD: SD_CARD.2 ; also sheet 1
SD_DAT0: SD_CARD.7 ; also sheet 1
SD_DAT1: SD_CARD.8 ; also sheet 1
SD_DAT2: SD_CARD.9 ; also sheet 1
SD_DAT3: SD_CARD.1 ; also sheet 1
SD_WP: R25.1 SD_CARD.WP ; also sheet 1
VD33: C56.1 R24.2 R25.2 SD_CARD.4 ; also sheet 1,2,7,8,9

### Buses
SD:SD_CLK,SD_CMD,SD_DAT0,SD_DAT1,SD_DAT2,SD_DAT3,SD_CD,SD_WP

## Sheet 7 of 10: Audio
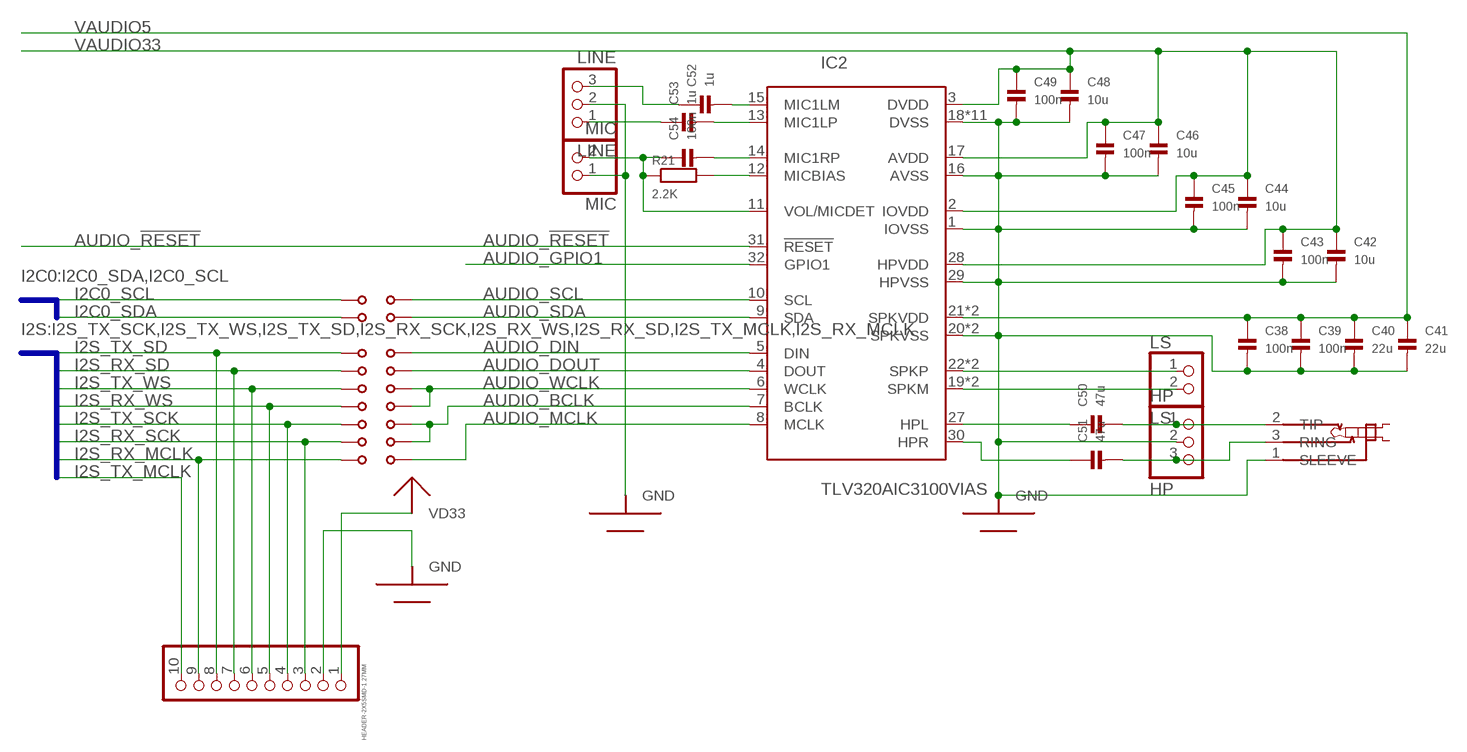
[diagram p6: schematic, sheet 7]

### Parts
A_SCL  JUMPERSOLDER_CLOSED  [0603_SOLDERJUMPER_CLOSED]
A_SDA  JUMPERSOLDER_CLOSED  [0603_SOLDERJUMPER_CLOSED]
C38  100n  CAP_CERAMIC0603  [0603]
C39  100n  CAP_CERAMIC0603  [0603]
C40  22u  CAP_CERAMIC0603  [0603]
C41  22u  CAP_CERAMIC0603  [0603]
C42  10u  CAP_CERAMIC0603  [0603]
C43  100n  CAP_CERAMIC0603  [0603]
C44  10u  CAP_CERAMIC0603  [0603]
C45  100n  CAP_CERAMIC0603  [0603]
C46  10u  CAP_CERAMIC0603  [0603]
C47  100n  CAP_CERAMIC0603  [0603]
C48  10u  CAP_CERAMIC0603  [0603]
C49  100n  CAP_CERAMIC0603  [0603]
C50  47u  CAP_CERAMIC0805  [0805]
C51  47u  CAP_CERAMIC0805  [0805]
C52  1u  CAP_CERAMIC0603  [0603]
C53  1u  CAP_CERAMIC0603  [0603]
C54  100n  CAP_CERAMIC0603  [0603]
HEADPHONE  AUDIOJACK-STEREO-3PCUI_SJ_3523  [CUI_SJ_3523_SMT]
HP  HP  HEADER-1X3ROUND  [1X03_ROUND]
I2S  HEADER-2X5SMD-1.27MM  [2X05_SMT]
IC2  TLV320AIC3100VIAS  [QFN32-0.5-EP-VIAS]
LINE  LINE  HEADER-1X3ROUND  [1X03_ROUND]
LS  LS  HEADER-1X2ROUND  [1X02_ROUND]
MCLK  JUMPERSOLDER_CLOSED  [0603_SOLDERJUMPER_CLOSED]
MIC  MIC  HEADER-1X2ROUND  [1X02_ROUND]
R21  2.2K  R-EU_0603  [0603]
RX_SCK  JUMPERSOLDER_CLOSED  [0603_SOLDERJUMPER_CLOSED]
RX_SD  JUMPERSOLDER_CLOSED  [0603_SOLDERJUMPER_CLOSED]
RX_WS  JUMPERSOLDER_CLOSED  [0603_SOLDERJUMPER_CLOSED]
TX_SCK  JUMPERSOLDER_CLOSED  [0603_SOLDERJUMPER_CLOSED]
TX_SD  JUMPERSOLDER_CLOSED  [0603_SOLDERJUMPER_CLOSED]
TX_WS  JUMPERSOLDER_CLOSED  [0603_SOLDERJUMPER_CLOSED]

### Nets
AUDIO_!RESET: IC2.31(!RESET) ; also sheet 1
AUDIO_BCLK: IC2.7(BCLK) RX_SCK.2 TX_SCK.2
AUDIO_DIN: IC2.5(DIN) TX_SD.2
AUDIO_DOUT: IC2.4(DOUT) RX_SD.2
AUDIO_GPIO1: IC2.32(GPIO1)
AUDIO_MCLK: IC2.8(MCLK) MCLK.2
AUDIO_SCL: A_SCL.2 IC2.10(SCL)
AUDIO_SDA: A_SDA.2 IC2.9(SDA)
AUDIO_WCLK: IC2.6(WCLK) RX_WS.2 TX_WS.2
GND: C38.2 C39.2 C40.2 C41.2 C42.2 C43.2 C44.2 C45.2 C46.2 C47.2 C48.2 C49.2 HEADPHONE.1(SLEEVE) HP.2 I2S.2 IC2.1(IOVSS) IC2.16(AVSS) IC2.18(DVSS) IC2.20(SPKVSS) IC2.25(SPKVSS) IC2.29(HPVSS) IC2.PAD(DVSS) IC2.VIA1(DVSS) IC2.VIA2(DVSS) IC2.VIA3(DVSS) IC2.VIA4(DVSS) IC2.VIA5(DVSS) IC2.VIA6(DVSS) IC2.VIA7(DVSS) IC2.VIA8(DVSS) IC2.VIA9(DVSS) LINE.2 MIC.1 ; also sheet 1,2,3,4,5,6,8,9
HP_L: C50.2 HEADPHONE.2(TIP) HP.1
HP_R: C51.2 HEADPHONE.3(RING) HP.3
HPL: C50.1 IC2.27(HPL)
HPR: C51.1 IC2.30(HPR)
I2C0_SCL: A_SCL.1 ; also sheet 1,8
I2C0_SDA: A_SDA.1 ; also sheet 1,8
I2S_RX_MCLK: I2S.9 MCLK.1 ; also sheet 1
I2S_RX_SCK: I2S.3 RX_SCK.1 ; also sheet 1
I2S_RX_SD: I2S.7 RX_SD.1 ; also sheet 1
I2S_RX_WS: I2S.5 RX_WS.1 ; also sheet 1
I2S_TX_MCLK: I2S.10 ; also sheet 1
I2S_TX_SCK: I2S.4 TX_SCK.1 ; also sheet 1
I2S_TX_SD: I2S.8 TX_SD.1 ; also sheet 1
I2S_TX_WS: I2S.6 TX_WS.1 ; also sheet 1
LINEIN1: C52.1 LINE.3
LINEIN2: C53.1 LINE.1
MIC1LM: C52.2 IC2.15(MIC1LM)
MIC1LP: C53.2 IC2.13(MIC1LP)
MIC1RP: C54.2 IC2.14(MIC1RP)
MICBIAS: IC2.12(MICBIAS) R21.2
N$4: C54.1 IC2.11(VOL/MICDET) MIC.2 R21.1
SPKM: IC2.19(SPKM) IC2.23(SPKM) LS.2
SPKP: IC2.22(SPKP) IC2.26(SPKP) LS.1
VAUDIO5 [supply2000]: C38.1 C39.1 C40.1 C41.1 IC2.21(SPKVDD) IC2.24(SPKVDD) ; also sheet 2
VAUDIO33: C42.1 C43.1 C44.1 C45.1 C46.1 C47.1 C48.1 C49.1 IC2.2(IOVDD) IC2.3(DVDD) IC2.17(AVDD) IC2.28(HPVDD) ; also sheet 2
VD33: I2S.1 ; also sheet 1,2,6,8,9

### Buses
I2S:I2S_TX_SCK,I2S_TX_WS,I2S_TX_SD,I2S_RX_SCK,I2S_RX_WS,I2S_RX_SD,I2S_TX_MCLK,I2S_RX_MCLK
I2C0:I2C0_SDA,I2C0_SCL

## Sheet 8 of 10: IO
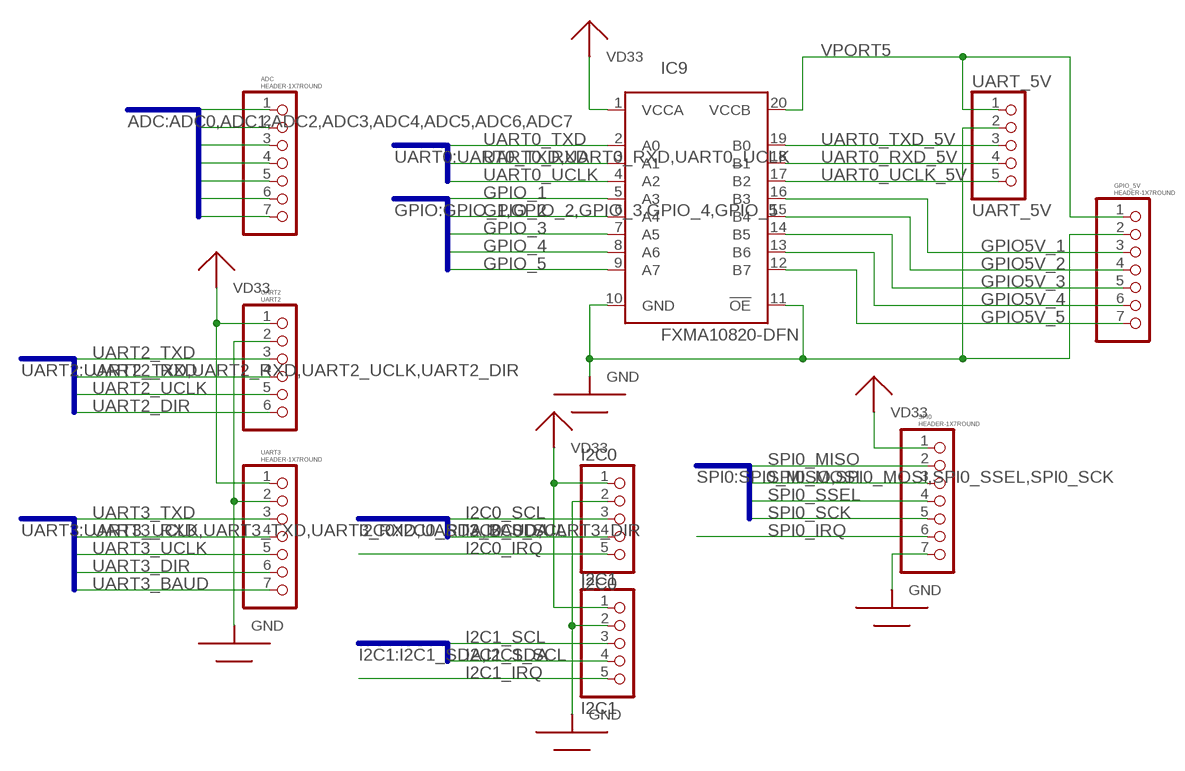
[diagram p7: schematic, sheet 8]

### Parts
ADC  HEADER-1X7ROUND  [1X07_ROUND]
GPIO_5V  HEADER-1X7ROUND  [1X07_ROUND]
I2C0  I2C0  HEADER-1X5ROUND  [1X05_ROUND]
I2C1  I2C1  HEADER-1X5ROUND  [1X05_ROUND]
IC9  FXMA10820-DFN  [FXMA108]
SPI0  HEADER-1X7ROUND  [1X07_ROUND]
UART2  UART2  HEADER-1X6ROUND  [1X06_ROUND]
UART3  HEADER-1X7ROUND  [1X07_ROUND]
UART_5V  UART_5V  HEADER-1X5ROUND  [1X05_ROUND]

### Nets
ADC0: ADC.1 ; also sheet 1
ADC1: ADC.2 ; also sheet 1
ADC2: ADC.3 ; also sheet 1
ADC3: ADC.4 ; also sheet 1
ADC4: ADC.5 ; also sheet 1
ADC5: ADC.6 ; also sheet 1
ADC6: ADC.7 ; also sheet 1,2
GND: GPIO_5V.2 I2C0.2 I2C1.2 IC9.10(GND) IC9.11(!OE) SPI0.7 UART2.2 UART3.2 UART_5V.2 ; also sheet 1,2,3,4,5,6,7,9
GPIO5V_1: GPIO_5V.3 IC9.16(B3)
GPIO5V_2: GPIO_5V.4 IC9.15(B4)
GPIO5V_3: GPIO_5V.5 IC9.14(B5)
GPIO5V_4: GPIO_5V.6 IC9.13(B6)
GPIO5V_5: GPIO_5V.7 IC9.12(B7)
GPIO_1: IC9.5(A3) ; also sheet 1
GPIO_2: IC9.6(A4) ; also sheet 1
GPIO_3: IC9.7(A5) ; also sheet 1
GPIO_4: IC9.8(A6) ; also sheet 1
GPIO_5: IC9.9(A7) ; also sheet 1
I2C0_IRQ: I2C0.5 ; also sheet 1
I2C0_SCL: I2C0.3 ; also sheet 1,7
I2C0_SDA: I2C0.4 ; also sheet 1,7
I2C1_IRQ: I2C1.5 ; also sheet 1
I2C1_SCL: I2C1.3 ; also sheet 1
I2C1_SDA: I2C1.4 ; also sheet 1
SPI0_IRQ: SPI0.6 ; also sheet 1
SPI0_MISO: SPI0.2 ; also sheet 1
SPI0_MOSI: SPI0.3 ; also sheet 1
SPI0_SCK: SPI0.5 ; also sheet 1
SPI0_SSEL: SPI0.4 ; also sheet 1
UART0_RXD: IC9.3(A1) ; also sheet 1
UART0_RXD_5V: IC9.18(B1) UART_5V.4
UART0_TXD: IC9.2(A0) ; also sheet 1
UART0_TXD_5V: IC9.19(B0) UART_5V.3
UART0_UCLK: IC9.4(A2) ; also sheet 1
UART0_UCLK_5V: IC9.17(B2) UART_5V.5
UART2_DIR: UART2.6 ; also sheet 1
UART2_RXD: UART2.4 ; also sheet 1
UART2_TXD: UART2.3 ; also sheet 1
UART2_UCLK: UART2.5 ; also sheet 1
UART3_BAUD: UART3.7 ; also sheet 1
UART3_DIR: UART3.6 ; also sheet 1
UART3_RXD: UART3.4 ; also sheet 1
UART3_TXD: UART3.3 ; also sheet 1
UART3_UCLK: UART3.5 ; also sheet 1
VD33: I2C0.1 I2C1.1 IC9.1(VCCA) SPI0.1 UART2.1 UART3.1 ; also sheet 1,2,6,7,9
VPORT5 [supply2000]: GPIO_5V.1 IC9.20(VCCB) UART_5V.1 ; also sheet 2

### Buses
ADC:ADC0,ADC1,ADC2,ADC3,ADC4,ADC5,ADC6,ADC7
I2C0:I2C0_SDA,I2C0_SCL
UART0:UART0_TXD,UART0_RXD,UART0_UCLK
GPIO:GPIO_1,GPIO_2,GPIO_3,GPIO_4,GPIO_5
I2C1:I2C1_SDA,I2C1_SCL
SPI0:SPI0_MISO,SPI0_MOSI,SPI0_SSEL,SPI0_SCK
UART2:UART2_TXD,UART2_RXD,UART2_UCLK,UART2_DIR
UART3:UART3_UCLK,UART3_TXD,UART3_RXD,UART3_BAUD,UART3_DIR

## Sheet 9 of 10: Bluetooth
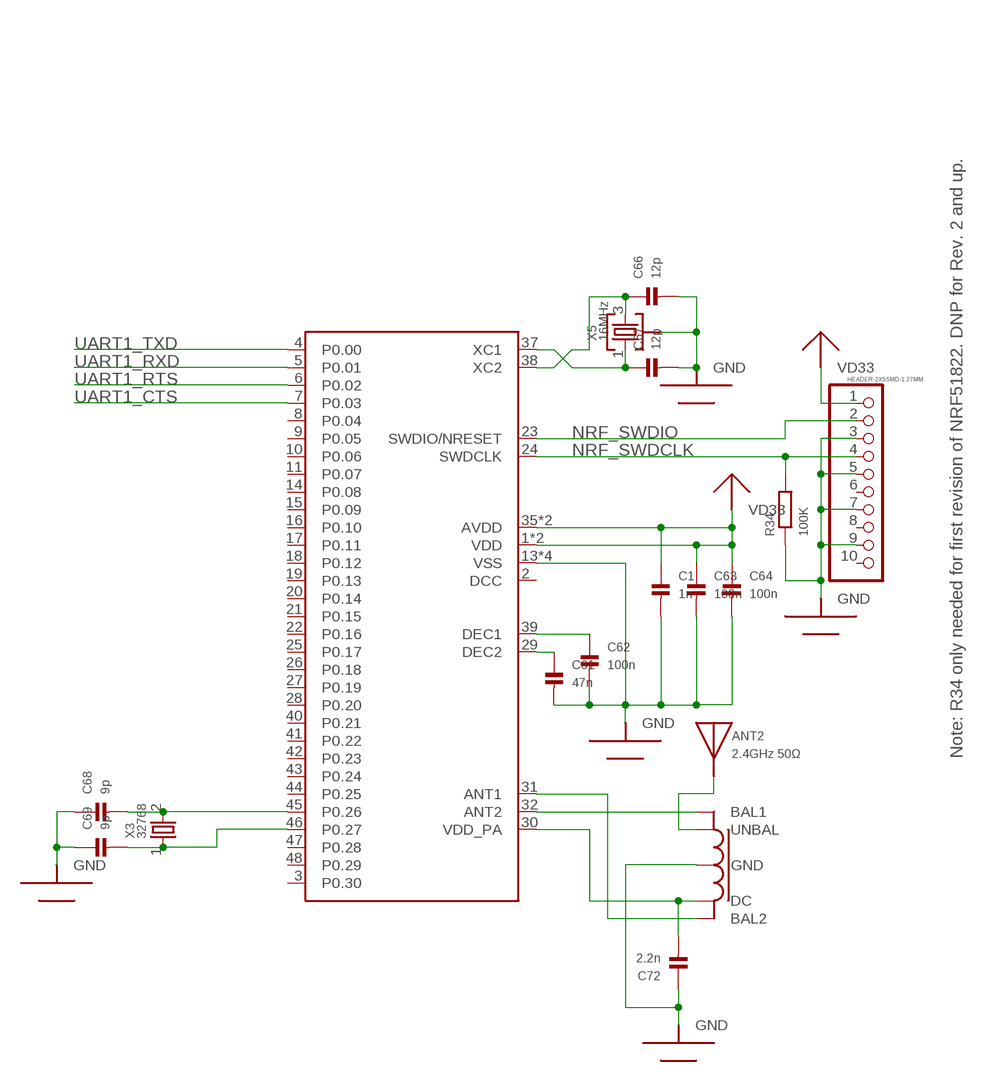
[diagram p8: schematic, sheet 9]

### Parts
ANT2  2.4GHz 50Ω  ANTENNA_MONOPOLE1206  [1206_MINIMELF_COMBO]
BAL1  BALUNWLCSP  [ST_BAL_WLCSP]
C1  1n  CAP_CERAMIC0402  [0402]
C61  47n  CAP_CERAMIC0402  [0402]
C62  100n  CAP_CERAMIC0402  [0402]
C63  100n  CAP_CERAMIC0402  [0402]
C64  100n  CAP_CERAMIC0402  [0402]
C66  12p  CAP_CERAMIC0402  [0402]
C67  12p  CAP_CERAMIC0402  [0402]
C68  9p  CAP_CERAMIC0402  [0402]
C69  9p  CAP_CERAMIC0402  [0402]
C72  2.2n  CAP_CERAMIC0402  [0402]
MCU1  NRF51822QFN48  [QFN48_EP]
NRF_DEBUG  HEADER-2X5SMD-1.27MM  [2X05_SMT]
R34  100K  R-EU_0603  [0603]
X3  32768  CRYSTAL1206  [1206_MINIMELF_COMBO]
X5  16MHz  CRYSTAL_WITH_GROUND25X20  [CRYSTAL25X20]

### Nets
BT_ANT: ANT2.1(ANT) BAL1.SE(UNBAL)
BT_ANT1: BAL1.DIFF2(BAL2) MCU1.31(ANT1)
BT_ANT2: BAL1.DIFF1(BAL1) MCU1.32(ANT2)
BT_DEC1: C62.P$1 MCU1.39(DEC1)
BT_DEC2: C61.P$1 MCU1.29(DEC2)
BT_VDD_PA: BAL1.VCC(DC) C72.P$2 MCU1.30(VDD_PA)
BT_XC1: C67.P$1 MCU1.37(XC1) X5.1
BT_XC2: C66.P$1 MCU1.38(XC2) X5.3
BT_XL1: C69.P$2 MCU1.46(P0.27) X3.1
BT_XL2: C68.P$2 MCU1.45(P0.26) X3.2
GND: BAL1.GND C1.P$2 C61.P$2 C62.P$2 C63.P$2 C64.P$2 C66.P$2 C67.P$2 C68.P$1 C69.P$1 C72.P$1 MCU1.13(VSS) MCU1.33(VSS) MCU1.34(VSS) MCU1.PAD(VSS) NRF_DEBUG.3 NRF_DEBUG.5 NRF_DEBUG.7 NRF_DEBUG.9 R34.1 X5.2(GND) X5.4(GND) ; also sheet 1,2,3,4,5,6,7,8
NRF_SWDCLK: MCU1.24(SWDCLK) NRF_DEBUG.4 R34.2 ; also sheet 1
NRF_SWDIO: MCU1.23(SWDIO/NRESET) NRF_DEBUG.2 ; also sheet 1
UART1_CTS: MCU1.7(P0.03) ; also sheet 1
UART1_RTS: MCU1.6(P0.02) ; also sheet 1
UART1_RXD: MCU1.5(P0.01) ; also sheet 1
UART1_TXD: MCU1.4(P0.00) ; also sheet 1
VD33: C1.P$1 C63.P$1 C64.P$1 MCU1.1(VDD) MCU1.12(VDD) MCU1.35(AVDD) MCU1.36(AVDD) NRF_DEBUG.1 ; also sheet 1,2,6,7,8
Unconnected: MCU1.2(DCC) MCU1.3(P0.30) MCU1.8(P0.04) MCU1.9(P0.05) MCU1.10(P0.06) MCU1.11(P0.07) MCU1.14(P0.08) MCU1.15(P0.09) MCU1.16(P0.10) MCU1.17(P0.11) MCU1.18(P0.12) MCU1.19(P0.13) MCU1.20(P0.14) MCU1.21(P0.15) MCU1.22(P0.16) MCU1.25(P0.17) MCU1.26(P0.18) MCU1.27(P0.19) MCU1.28(P0.20) MCU1.40(P0.21) MCU1.41(P0.22) MCU1.42(P0.23) MCU1.43(P0.24) MCU1.44(P0.25) MCU1.47(P0.28) MCU1.48(P0.29) NRF_DEBUG.6 NRF_DEBUG.8 NRF_DEBUG.10

### Notes on the sheet
- Note: R34 only needed for first revision of NRF51822. DNP for Rev. 2 and up.

## Sheet 10 of 10: other
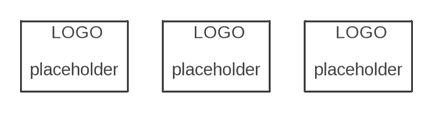
[diagram p9: schematic, sheet 10]

### Parts
LOGO2  LOGOKRONE  [LOGO-KRONE]
LOGO3  LOGOKRONE  [LOGO-KRONE]
LOGO4  LOGOKRONE  [LOGO-KRONE]

## Library data of the parts
5VDC_IN = everykey:JACK-PLUG: DC POWER JACK Power Jack, DC, Right Angle, Through Hole, Rated 5A at 16VDC, PC Terminals Distributor: Farnell (www.Farnell.de) Drawing: 84N1161.pdf / 84N1162.pdf Manufacturer: SPC Technology (www.spctechnology.com) Type: SPC4077 / SPC 4078
!PGM RESET = everykey:PUSHBUTTON: Push button 1 x momentary close switches
A_SCL A_SDA BATSNS LIM MCLK RX_SCK RX_SD RX_WS SCL SDA TX_SCK TX_SD TX_WS WL_EN = everykey:JUMPER: A jumper
ADC GPIO_5V SPI0 UART3 = everykey:HEADER-1X7
ANT1 ANT2 = everykey:ANTENNA_MONOPOLE
BAL1 = everykey:BALUN: BALUN
BATT = everykey:BATTERY_WITH_HOLDER: Battery with assignable mechanical pads/vias for better mechanical stability
C1-C59 C61-C70 C72 C74-C80 = everykey:CAP_CERAMIC: Ceramic Capacitors 0603 - 0603 Surface Mount Capacitors 3pF 250V +/-0.1pF RF Ceramic Capacitor[Digikey: 712-1347-1-ND] 16 pF 50V 5% Ceramic Capacitor[Digikey: 445-5051-2-ND] 18 pF 250V 5% RF Ceramic Capcitor [Digikey: 478-3505-1-ND] 22 pF 50V Ceramic Capacitor [Digikey: PCC220ACVTR-ND] 33 pF 50V 5% Ceramic Capacitor 56 pF 250V 5% C0G RF Ceramic Capcitor [Digikey: 490-4867-1-ND] 680 pF 50V Ceramic Capacitor 2200 pF 50V 5% C0G Ceramic Capacitor [Digikey: 445-1297-1-ND] 5600 pF 100V 5% X7R Ceramic Capacitor [Digikey: 478-3711-1-ND] 0.1 µF 25V 10% Ceramic Capacitor [Digikey: PCC2277TR-ND] 0.22 µF 16V 10% X7R Ceramic Capacitor [Digikey: 445-1318-1-ND] 1.0 µF 25V 10% Ceramic Capacitor [Digikey: 445-5146-2-ND] 0805 - 0805 Surface Mount Capacitors 220 pF 250V 2% RF Ceramic Capacitor [Digikey: 712-1398-1-ND] 1000 pF 50V 2% NP0 Ceramic Capacitor [Digikey: 478-3760-1-ND] 0.1 µF 25V 10% Ceramic Capacitor [Digikey: PCC1828TR-ND] 1.0 µF 16V 10% Ceramic Capacitor[Digikey: 490-1691-2-ND] 10.0 µF 10V 10% Ceramic Capacitor[Digikey: 709-1228-1-ND] 1206 - 1206 Surface Mount Capacitors
C60 = everykey:CPOL-EU: POLARIZED CAPACITOR, European symbol
CC_DEBUG I2S LPC_DEBUG NRF_DEBUG = everykey:HEADER-2X5
D1-D5 = everykey:DIODE: Dioden in allen Variationen, die mir bis jetzt über den Weg gelaufen sind.
ETH = everykey:ETHERNET_JACK_LEDS
HEADPHONE = everykey:AUDIOJACK-STEREO-3P: Audio jack, stereo, 3 pins (without plug detection)
HP LINE = everykey:HEADER-1X3: PIN HEADER
I2C0 I2C1 UART_5V = everykey:HEADER-1X5: PIN HEADER
IC1 = everykey:LAN8720A
IC2 = everykey:TLV320AIC3100
IC3 = everykey:TPS2500
IC4-IC8 = everykey:SKYWORKS_AAT4280A: Skyworks slew controlled power switch. 1.5-5.5V, 2.3A max.
IC9 = everykey:FXMA108: Fairchild 8-channel bidirectional level translator
L1 L5-L7 = everykey:INDUCTOR: Generic inductor
LED1-LED4 = everykey:LED: LED common
LOGO2-LOGO4 = everykey:LOGO: Generic artwork placeholder
LS MIC = everykey:HEADER-1X2: PIN HEADER
MCU = everykey:LPC1837JBD144: LPC Cortex M microcontroller, 18xx or 43xx series, JBD144 (LQFP 144) package
MCU1 = everykey:NRF51822
PWR1 = everykey:LTC4080: Linear Technology Li-Ion battery charger and buck regulator
R1-R47 = everykey:R-EU_: RESISTOR, European symbol
SD_CARD = everykey:SD_CARD
UART2 = everykey:HEADER-1X6: PIN HEADER
USB0 USB1 = everykey:USB_MICRO: Micro USB connector (A/B/OTG) with ID pin
WIFI = everykey:CC3000: TI WIFI module
X1 X3 = everykey:CRYSTAL
X2 X5 = everykey:CRYSTAL_WITH_GROUND
X4 = everykey:OSCILLATOR: Active oscillator, e.g. Si501/2/3

## Net classes
1 supply2000: width 0.2 mm, drill 0.3 mm
2 supply500: width 0.2 mm, drill 0.3 mm